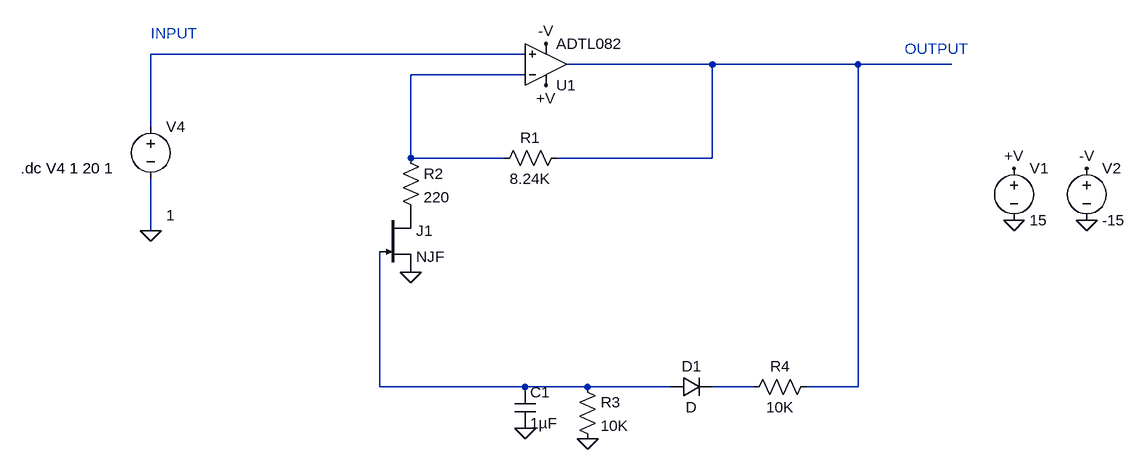
[diagram p0: schematic ampliACAG.asc]
ampliACAG.asc, the LTspice schematic file:
Version 4.1
SHEET 1 1508 852
WIRE 576 240 0 240
WIRE 864 256 640 256
WIRE 1088 256 864 256
WIRE 1232 256 1088 256
WIRE 576 272 400 272
WIRE 0 352 0 240
WIRE 400 400 400 272
WIRE 544 400 400 400
WIRE 864 400 864 256
WIRE 864 400 624 400
WIRE 0 512 0 432
WIRE 352 752 352 544
WIRE 576 752 352 752
WIRE 672 752 576 752
WIRE 800 752 672 752
WIRE 928 752 864 752
WIRE 1088 752 1088 256
WIRE 1088 752 1008 752
FLAG 0 512 0
FLAG 400 576 0
FLAG 576 816 0
FLAG 672 832 0
FLAG 1328 496 0
FLAG 1440 496 0
FLAG 1328 416 +V
FLAG 608 288 +V
FLAG 608 224 -V
FLAG 1440 416 -V
SYMBOL OpAmps\\ADTL082 608 320 M180
SYMATTR InstName U1
SYMBOL voltage 0 336 R0
WINDOW 3 24 152 Left 2
WINDOW 123 24 124 Left 2
WINDOW 39 0 0 Left 0
SYMATTR InstName V4
SYMATTR Value 1
SYMBOL res 640 384 R90
WINDOW 0 0 56 VBottom 2
WINDOW 3 32 56 VTop 2
SYMATTR InstName R1
SYMATTR Value 8.24K
SYMBOL res 384 384 R0
SYMATTR InstName R2
SYMATTR Value 220
SYMBOL njf 352 480 R0
SYMATTR InstName J1
SYMBOL cap 560 752 R0
SYMATTR InstName C1
SYMATTR Value 1µF
SYMBOL res 656 736 R0
SYMATTR InstName R3
SYMATTR Value 10K
SYMBOL diode 800 768 R270
WINDOW 0 32 32 VTop 2
WINDOW 3 0 32 VBottom 2
SYMATTR InstName D1
SYMBOL res 1024 736 R90
WINDOW 0 0 56 VBottom 2
WINDOW 3 32 56 VTop 2
SYMATTR InstName R4
SYMATTR Value 10K
SYMBOL voltage 1328 400 R0
WINDOW 123 0 0 Left 0
WINDOW 39 0 0 Left 0
SYMATTR InstName V1
SYMATTR Value 15
SYMBOL voltage 1440 400 R0
WINDOW 123 0 0 Left 0
WINDOW 39 0 0 Left 0
SYMATTR InstName V2
SYMATTR Value -15
TEXT 1160 232 Left 2 ;OUTPUT
TEXT 0 208 Left 2 ;INPUT
TEXT -200 416 Left 2 !.dc V4 1 20 1

The netlist it stands for:
* ampliACAG.asc
X§U1 N001 N003 +V -V N002 ADTL082  ; pins In+ In- V+ V- OUT
V4 N001 0 1
R1 N002 N003 8.24K
R2 N003 P001 220
J1 P001 N004 0 NJF
C1 N004 0 1µF
R3 N004 0 10K
D1 N004 N005 D
R4 N002 N005 10K
V1 +V 0 15
V2 -V 0 -15
.model D D
.lib standard.dio
.model NJF NJF
.model PJF PJF
.lib standard.jft
* OUTPUT
* INPUT
.dc V4 1 20 1
.lib ADI.lib
.backanno
.end